# Altium schematic sheet LM2596.SchDoc
size A4
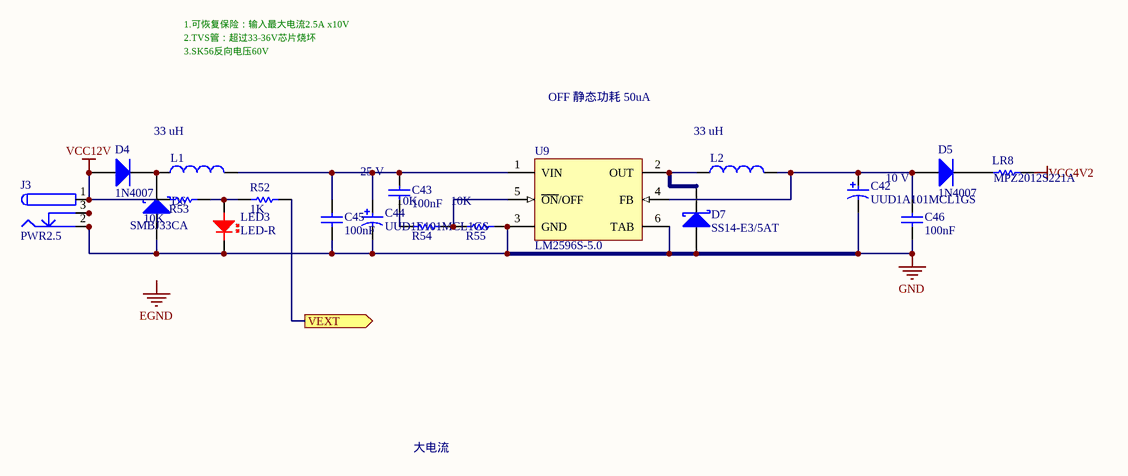
[diagram p0: LM2596.SchDoc]

## Parts
C42  UUD1A101MCL1GS  Rated Voltage: 10 V  [NIC-CAPA2-6.3X5.8_V]
C43  value 100nF  [2012[0805]06CD]  (hidden comment: CAP 100nF 50V 0805(2012))
C44  UUD1E101MCL1GS  Rated Voltage: 25 V  [NIC-CAPA2-6.3X7.7_V]
C45  value 100nF  [2012[0805]06CD]  (hidden comment: CAP 100nF 50V 0805(2012))
C46  value 100nF  [2012[0805]06CD]  (hidden comment: CAP 100nF 50V 0805(2012))
D4  1N4007  [DO-214AC/SMA]
D5  1N4007  [DO-214AC/SMA]
D6  SMBJ33CA  [DO-214AA/SMB]
D7  SS14-E3/5AT  [VISH-DO-214AC-2_V]
J3  PWR2.5  [KLD-0202]
L1  Inductance: 33 uH  [INDP5050X28N]  (hidden comment: SLF7045T-330M1R1-H)
L2  Inductance: 33 uH  [INDP5050X28N]  (hidden comment: SLF7045T-330M1R1-H)
LED3  LED-R  [0805LED]
LR8  MPZ2012S221A  [2012[0805]RL]
R52  value 1K  [2012[0805]R]  (hidden comment: 1K 1% 0805(2012))
R53  value 10K  [2012[0805]R]  (hidden comment: 10K 1% 0805(2012))
R54  value 10K  [2012[0805]R]  (hidden comment: 10K 1% 0805(2012))
R55  value 10K  [2012[0805]R]  (hidden comment: 10K 1% 0805(2012))
U9  LM2596S-5.0  [TS5B_N]

## Ports
VEXT (out)

## Nets
GND: C42.2 C44.2 C45.2 C46.2 D6.1(A) D7.1(A) J3.2 J3.2A J3.2B LED3.2 R55.2 U9.3(GND) U9.6(TAB)
VCC4V2: LR8.2
VCC12V: D4.1(A) J3.1 J3.1A J3.1B R53.1
VEXT: R52.1 ; port VEXT
NetC42_1: C42.1 C46.1 D5.1(A) L2.2 U9.4(FB)
NetC43_1: C43.1 C44.1 C45.1 L1.2 U9.1(VIN)
NetC43_2: C43.2 R54.1
NetD4_2: D4.2(K) D6.2(K) L1.1
NetD5_2: D5.2(K) LR8.1
NetD7_2: D7.2(K) L2.1 U9.2(OUT)
NetJ3_3: J3.3 J3.3A J3.3B
NetLED3_1: LED3.1 R52.2 R53.2
NetR54_2: R54.2 R55.1 U9.5(~{ON}/OFF)

## Notes on the sheet
- 1.可恢复保险：输入最大电流2.5A x10V
- 2.TVS管：超过33-36V芯片烧坏
- 3.SK56反向电压60V
- OFF 静态功耗 50uA
- 大电流
- Labels drawn without touching a wire or pin: EGND

## Library data of the parts
C42 = CMP-0687-00054-1: Aluminum Electrolytic Capacitor, UD Series, Low Impedance, 100 uF, 10 V, + / - 20%, -55 to 105 degC, Chip Type, 6.3 x 5.8 mm D x L, Pb-Free, Reel; Manufacturer: Nichicon; Endurance Time: 2000 h; Packing: Dia382mm Reel; Tolerance Rated Capacitance: -20 to 20%; Rated Capacitance: 100 uF; Impedance: 0.44 Ohm; Rated Ripple Current (at 100kHz): 230 mA; ComponentLink1Description: Manufacturer URL; RoHS: TRUE; ComponentLink2Description: Datasheet; PackageReference: CAPAE-D6.3H5.8; Length: 5.8 mm; DatasheetVersion: 08/2012; ComponentLink3URL: http://products.nichicon.co.jp/en/pdf/XJA043/e-ud.pdf; ComponentLink1URL: http://www.nichicon.co.jp/; ComponentLink2URL: http://products.nichicon.co.jp/en/pdf/XJA043/e-ud.pdf; PartNumber: UUD1A101MCL1GS; PackageDescription: 2-Pin Surface Mount Device, Diameter 6.3 mm, Height 5.8 mm, Pitch 5.4 mm; ComponentLink3Description: Package Specification; Mounting Technology: Surface Mount; Diameter: 6.3 mm
C43 C45 C46 = CMP-1036-04418-1: CAP 100nF 50V ±5% 0805 (2012 Metric) Thickness 1mm SMD; Case-EIA: 0805; Case-Metric: 2012; Tolerance: ±5%; Max Thickness: 1 mm; Technology: SMT; Rated Voltage: 50 V
C44 = CMP-0687-00063-1: Aluminum Electrolytic Capacitor, UD Series, Low Impedance, 100 uF, 25 V, + / - 20%, -55 to 105 degC, Chip Type, 6.3 x 7.7 mm D x L, Pb-Free, Reel; Manufacturer: Nichicon; Rated Ripple Current (at 100kHz): 280 mA; Endurance Time: 2000 h; Packing: Dia382mm Reel; Tolerance Rated Capacitance: -20 to 20%; Impedance: 0.34 Ohm; Rated Capacitance: 100 uF; PackageReference: CAPAE-D6.3H7.7; RoHS: TRUE; PackageDescription: 2-Pin Surface Mount Device, Diameter 6.3 mm, Height 7.7 mm, Pitch 5.4 mm; Mounting Technology: Surface Mount; ComponentLink3Description: Package Specification; Diameter: 6.3 mm; DatasheetVersion: 08/2012; PartNumber: UUD1E101MCL1GS; ComponentLink3URL: http://products.nichicon.co.jp/en/pdf/XJA043/e-ud.pdf; Length: 7.7 mm; ComponentLink2Description: Datasheet; ComponentLink2URL: http://products.nichicon.co.jp/en/pdf/XJA043/e-ud.pdf; ComponentLink1Description: Manufacturer URL; ComponentLink1URL: http://www.nichicon.co.jp/
D4 D5 = 1N4007: 1.0 Ampere General Purpose Rectifier; Published: 8-Jun-2000; LatestRevisionDate: 17-Jul-2002; LatestRevisionNote: Re-released for DXP Platform.; DatasheetDocument: 1998; PackageDocument: Aug-1999; PackageReference: DO-41; Publisher: Altium Limited; Code_JEDEC: DO-204-AL; ComponentLink1Description: Manufacturer Link; ComponentLink1URL: http://www.fairchildsemi.com/; ComponentLink2Description: Pinout Specification; ComponentLink2URL: http://www.fairchildsemi.com/ds/1N%2F1N4001.pdf
D6 = 30BQ040: TVS; Manufacturer: Fairchild Semiconductor; Type: Zener; Bidirectional Channels: 1; Voltage - Reverse Standoff (Typ): 33V; Voltage - Breakdown (Min): 36.7V; Voltage - Clamping (Max) @ Ipp: 53.3V; Current - Peak Pulse (10/1000µs): 11.3A; Power - Peak Pulse: 600W; Power Line Protection: No; Supplier 1: Digi-Key; Supplier Part Number 1: SMBJ33CAFSCT-ND; Manufacturer Part Number: SMBJ33CA; RoHS: RoHS Compliant; Category: Circuit Protection; Stock 1: 9879; Pricing 1: 1=0.58, 10=0.411, 25=0.3372, 100=0.2695, 250=0.19636, 500=0.15946, 1000=0.12257 (USD); Packaging: Cut Tape (CT); Unidirectional Channels: -; Applications: General Purpose; Capacitance @ Frequency: -; Operating Temperature: -55°C ~ 150°C (TJ); Mounting Type: Surface Mount; Package / Case: DO-214AA, SMB; Supplier Device Package: DO-214AA (SMB); ComponentLink1URL: http://www.fairchildsemi.com/datasheets/SM/SMBJ100A.pdf; ComponentLink1Description: http://www.fairchildsemi.com/datasheets/SM/SMBJ100A.pdf
D7 = CMP-0549-00004-1: Schottky Barrier Rectifier, 40 V Maximum DC Blocking Voltage, -65 to 125 degC, 2-Pin SMA Case, RoHS; Manufacturer: Vishay Semiconductor; IFSM: 40 A; IF(AV): 1 A Max.; VRRM: 40 V Max.; VRMS: 28 V Max.; PackageReference: DO-214AC-2; RoHS: TRUE; DatasheetVersion: 12/17/2012; ComponentLink1Description: Manufacturer URL; ComponentLink2URL: http://www.vishay.com/docs/88746/ss12.pdf; PartNumber: SS14-E3/5AT; PackageVersion: Dec-12; Operating Temperature: -65 to 125 degC; ComponentLink3URL: http://www.vishay.com/docs/88746/ss12.pdf; PackageDescription: 2-Pin SMD, Body 4.245 x 2.665 mm, Height 2.29 mm; ComponentLink1URL: http://www.vishay.com/; ComponentLink3Description: Package Specification; ComponentLink2Description: Datasheet; Mounting Technology: Surface Mount; VDC: 40 V Max.
J3 = PWR2.5: Low Voltage Power Supply Connector; Published: 17-Dec-2003; DatasheetDocument: 09-May-2002; Publisher: Altium Limited; ComponentLink1Description: Manufacturer Link; ComponentLink1URL: http://domino.kycon.com/internet/Products.html
L1 L2 = Inductor: 固定电感器 SMD Power Inductor; Manufacturer: TDK; Core Material: Ferrite; Maximum DC Current: 1.1 A; Maximum DC Resistance: 96 mOhms; Shielding: Shielded; Tolerance: 20 %; Type: Wound Ferrite Inductor for Power Circuits; Case Height: 4.5 mm; Case Length: 7 mm; Test Frequency: 100 kHz; Supplier 1: Mouser; Supplier Part Number 1: 810-SLF7045T330M1R1H; Manufacturer Part Number: SLF7045T-330M1R1-H; RoHS: RoHS Compliant; Category: Fixed Inductors; Stock 1: 17; Pricing 1: 1=1.84, 10=1.38, 100=1.06, 500=0.780, 1000=0.734, 2000=0.689, 10000=0.666, 25000=0.643 (AUD); Operating Temperature Range: - 40 C to + 105 C; Package / Case: 7045 metric; Packaging: Reel; Product: Power Inductors; Series: SLF; Termination Style: SMD/SMT; Brand: TDK; Case Width: 7 mm; Product Category: Magnetic Shielded SMD Inductors; Standard Pack Qty: 1000; RoHS - Mouser: Y; Minimum Order Quantity: 1; Reeling: True; ComponentLink1URL: http://www.mouser.com/catalog/specsheets/tdk_e531_slf.pdf; ComponentLink1Description: http://www.mouser.com/catalog/specsheets/tdk_e531_slf.pdf
LED3 = LED-RED: 红色LED
LR8 = Res Semi: 电磁干扰滤波珠子、扼流圈和阵列 Ferrite Chip Beads; Manufacturer: TDK; 阻抗: 220 Ohms; 最大直流电流: 3 A; 最大直流电阻: 0.04 Ohms; 工作温度范围: - 55 C to + 125 C; 封装 / 箱体: 2012; 封装: Reel; 端接类型: SMD/SMT; 容差: 25 %; 产品种类: Ferrite Beads; 标准包装数量: 4000; Supplier 1: Mouser; Supplier Part Number 1: 810-MPZ2012S221A; Manufacturer Part Number: MPZ2012S221A; RoHS: RoHS Compliant; Description 1: 电磁干扰滤波珠子、扼流圈和阵列 Ferrite Chip Beads; Category: 电磁干扰滤波珠子、扼流圈和阵列; Stock 1: 26540; Pricing 1: 1=0.070, 50=0.060, 100=0.053, 500=0.040, 1000=0.035, 4000=0.031, 8000=0.029, 12000=0.025 (USD); 制造商: TDK; RoHS - 贸泽: Y; Minimum Order Quantity: 1; Reeling: True; ComponentLink1URL: http://www.mouser.com/ds/2/400/e9413_mpz-24582.pdf; ComponentLink1Description: http://www.mouser.com/ds/2/400/e9413_mpz-24582.pdf
R52 = CMP-1013-00510-1: 1K 0.125W 1% 0805 (2012 Metric)  SMD; Case-Metric: 2012; Case-EIA: 0805; Tolerance: 1 %; Power: 0.125 W; Technology: SMT
R53-R55 = CMP-1013-00623-1: 10K 0.125W 1% 0805 (2012 Metric)  SMD; Case-Metric: 2012; Case-EIA: 0805; Tolerance: 1 %; Power: 0.125 W; Technology: SMT
U9 = LM2596S-5.0: SIMPLE SWITCHER?Power Converter 150 KHz 3A Step-Down Voltage Regulator, 5-pin TO-263; Manufacturer: National Semiconductor; PackageTopMarking: NSUZXYTTE#*LM2596S*-5.0 P+; PowerWise: N; High-Reliability: Y; DatasheetVersion: May-2002; PackageVersion: revD, Apr-2005; PackageReference: TS5B; PackageDescription: TO-263, Molded, .400 x .390 x .180in, 5 Lead, .067in Pitch, Surface Mount; PartNumber: LM2596S-5.0; RoHS: N; PinCount: 5; CompType: Switcher; Code_JEDEC: MO-169-AB; ComponentLink1Description: Manufacturer URL; ComponentLink1URL: http://www.national.com/; ComponentLink2Description: LM2596 Datasheet; ComponentLink2URL: http://www.national.com/ds/LM/LM2596.pdf; ComponentLink3Description: LM2596 Web Page; ComponentLink3URL: http://www.national.com/pf/LM/LM2596.html; ComponentLink4Description: TS5B Package Page; ComponentLink4URL: http://www.national.com/packaging/folders/ts5b.html